# Altium schematic sheet CPLD-V-HEADERBANK.SchDoc
size A4; SheetNumber: 3; SheetTotal: 3
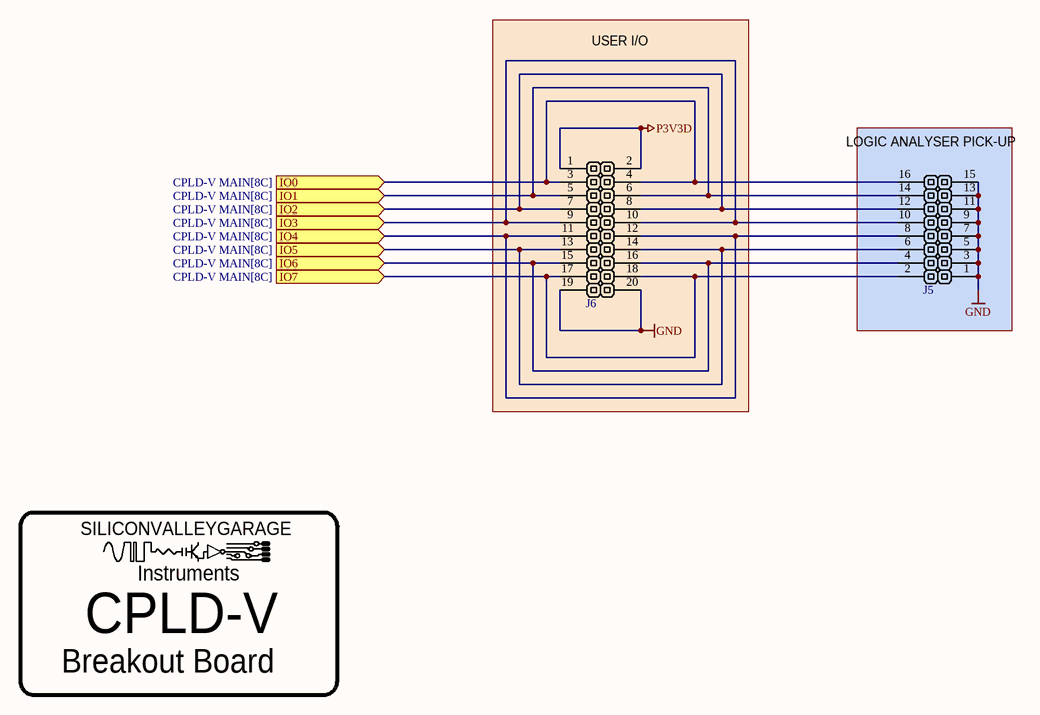
[diagram p0: CPLD-V-HEADERBANK.SchDoc]

## Parts
J5  BOXHEADER-3X2  [CONNECTOR-GENERIC-PINHEADER-2X8]  (value not drawn)
J6  BOXHEADER-3X2  [CONNECTOR-GENERIC-PINHEADER-2X10]  (value not drawn)
LOGO?  LOGO-SILICONVALLEYGARAGE-SMALL  [SILICONVALLEYGARAGE]  (value not drawn)  (graphical)

## Blocks framed on the sheet
USER I/O: J6
LOGIC ANALYSER PICK-UP: J5
CPLD-V: LOGO?

## Ports
IO0 (in, see CPLD-V MAIN[8C]), IO1 (in, see CPLD-V MAIN[8C]), IO2 (in, see CPLD-V MAIN[8C]), IO3 (in, see CPLD-V MAIN[8C]), IO4 (in, see CPLD-V MAIN[8C]), IO5 (in, see CPLD-V MAIN[8C]), IO6 (in, see CPLD-V MAIN[8C]), IO7 (in, see CPLD-V MAIN[8C])

## Nets
GND: J5.1(+) J5.3(-) J5.5(-) J5.7(-) J5.9(-) J5.11(-) J5.13(-) J5.15(-) J6.19(-) J6.20(-)
P3V3D: J6.1(+) J6.2(-)
IO0: J5.16(-) J6.3(-) J6.4(-) ; port IO0
IO1: J5.14(-) J6.5(-) J6.6(-) ; port IO1
IO2: J5.12(-) J6.7(-) J6.8(-) ; port IO2
IO3: J5.10(-) J6.9(-) J6.10(-) ; port IO3
IO4: J5.8(-) J6.11(-) J6.12(-) ; port IO4
IO5: J5.6(-) J6.13(-) J6.14(-) ; port IO5
IO6: J5.4(-) J6.15(-) J6.16(-) ; port IO6
IO7: J5.2(-) J6.17(-) J6.18(-) ; port IO7

## Notes on the sheet
- (near LOGO?) Instruments
- Breakout Board
- (in symbol LOGO-SILICONVALLEYGARAGE-SMALL) SILICONVALLEYGARAGE

## Library data of the parts
J5 = CONN-HEADER-MALE-2X8: CONN,HEADER,2X8,2.54mm; LCSC: C42431826
J6 = CONN-HEADER-MALE-2X10: CONN,HEADER,2X10,2.54mm; LCSC: C5383109
LOGO? = LOGO-SILICONVALLEYGARAGE-SMALL: LOGO,SILICONVALLEYGARAGE,SMALL